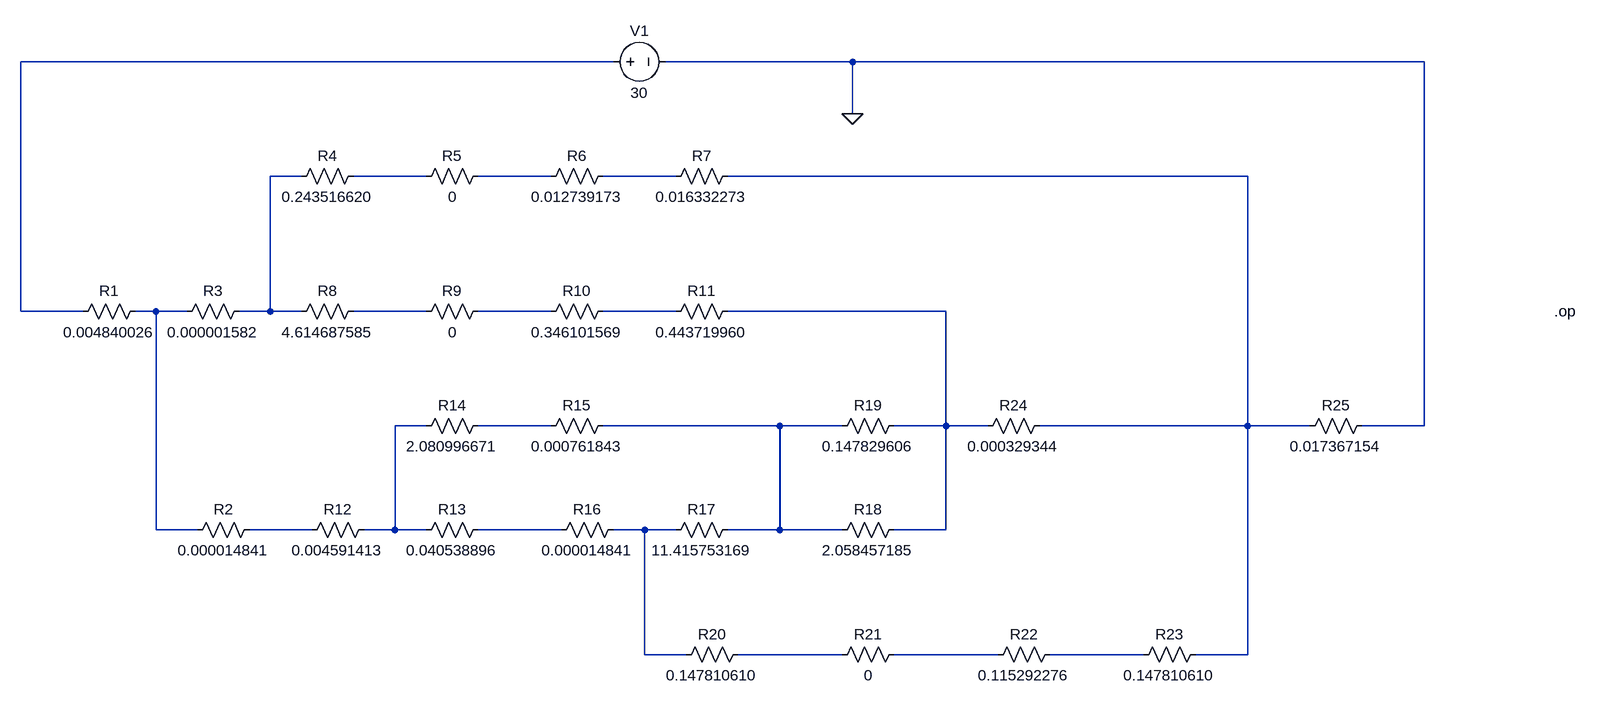
[diagram p0: schematic ceiling_thermal_model_xps.asc]
ceiling_thermal_model_xps.asc, the LTspice schematic file:
Version 4
SHEET 1 1964 856
WIRE 480 -96 -432 -96
WIRE 848 -96 560 -96
WIRE 1728 -96 848 -96
WIRE 848 -16 848 -96
WIRE 0 80 -48 80
WIRE 192 80 80 80
WIRE 384 80 272 80
WIRE 576 80 464 80
WIRE 1456 80 656 80
WIRE -432 288 -432 -96
WIRE -336 288 -432 288
WIRE -224 288 -256 288
WIRE -176 288 -224 288
WIRE -48 288 -48 80
WIRE -48 288 -96 288
WIRE 0 288 -48 288
WIRE 192 288 80 288
WIRE 384 288 272 288
WIRE 576 288 464 288
WIRE 992 288 656 288
WIRE 192 464 144 464
WIRE 384 464 272 464
WIRE 736 464 464 464
WIRE 832 464 736 464
WIRE 992 464 992 288
WIRE 992 464 912 464
WIRE 1056 464 992 464
WIRE 1456 464 1456 80
WIRE 1456 464 1136 464
WIRE 1552 464 1456 464
WIRE 1728 464 1728 -96
WIRE 1728 464 1632 464
WIRE -224 624 -224 288
WIRE -160 624 -224 624
WIRE 16 624 -80 624
WIRE 144 624 144 464
WIRE 144 624 96 624
WIRE 192 624 144 624
WIRE 400 624 272 624
WIRE 528 624 480 624
WIRE 576 624 528 624
WIRE 736 624 736 464
WIRE 736 624 656 624
WIRE 832 624 736 624
WIRE 992 624 992 464
WIRE 992 624 912 624
WIRE 528 816 528 624
WIRE 592 816 528 816
WIRE 832 816 672 816
WIRE 1072 816 912 816
WIRE 1296 816 1152 816
WIRE 1456 816 1456 464
WIRE 1456 816 1376 816
FLAG 848 -16 0
SYMBOL res -352 304 R270
WINDOW 0 32 56 VTop 2
WINDOW 3 0 56 VBottom 2
SYMATTR InstName R1
SYMATTR Value 0.004840026
SYMBOL res -176 640 R270
WINDOW 0 32 56 VTop 2
WINDOW 3 0 56 VBottom 2
SYMATTR InstName R2
SYMATTR Value 0.000014841
SYMBOL res -192 304 R270
WINDOW 0 32 56 VTop 2
WINDOW 3 0 56 VBottom 2
SYMATTR InstName R3
SYMATTR Value 0.000001582
SYMBOL res -16 96 R270
WINDOW 0 32 56 VTop 2
WINDOW 3 0 56 VBottom 2
SYMATTR InstName R4
SYMATTR Value 0.243516620
SYMBOL res 176 96 R270
WINDOW 0 32 56 VTop 2
WINDOW 3 0 56 VBottom 2
SYMATTR InstName R5
SYMATTR Value 0
SYMBOL res 368 96 R270
WINDOW 0 32 56 VTop 2
WINDOW 3 0 56 VBottom 2
SYMATTR InstName R6
SYMATTR Value 0.012739173
SYMBOL res 560 96 R270
WINDOW 0 32 56 VTop 2
WINDOW 3 0 56 VBottom 2
SYMATTR InstName R7
SYMATTR Value 0.016332273
SYMBOL res -16 304 R270
WINDOW 0 32 56 VTop 2
WINDOW 3 0 56 VBottom 2
SYMATTR InstName R8
SYMATTR Value 4.614687585
SYMBOL res 176 304 R270
WINDOW 0 32 56 VTop 2
WINDOW 3 0 56 VBottom 2
SYMATTR InstName R9
SYMATTR Value 0
SYMBOL res 368 304 R270
WINDOW 0 32 56 VTop 2
WINDOW 3 0 56 VBottom 2
SYMATTR InstName R10
SYMATTR Value 0.346101569
SYMBOL res 560 304 R270
WINDOW 0 32 56 VTop 2
WINDOW 3 0 56 VBottom 2
SYMATTR InstName R11
SYMATTR Value 0.443719960
SYMBOL res 0 640 R270
WINDOW 0 32 56 VTop 2
WINDOW 3 0 56 VBottom 2
SYMATTR InstName R12
SYMATTR Value 0.004591413
SYMBOL res 176 640 R270
WINDOW 0 32 56 VTop 2
WINDOW 3 0 56 VBottom 2
SYMATTR InstName R13
SYMATTR Value 0.040538896
SYMBOL res 176 480 R270
WINDOW 0 32 56 VTop 2
WINDOW 3 0 56 VBottom 2
SYMATTR InstName R14
SYMATTR Value 2.080996671
SYMBOL res 368 480 R270
WINDOW 0 32 56 VTop 2
WINDOW 3 0 56 VBottom 2
SYMATTR InstName R15
SYMATTR Value 0.000761843
SYMBOL res 384 640 R270
WINDOW 0 32 56 VTop 2
WINDOW 3 0 56 VBottom 2
SYMATTR InstName R16
SYMATTR Value 0.000014841
SYMBOL res 560 640 R270
WINDOW 0 32 56 VTop 2
WINDOW 3 0 56 VBottom 2
SYMATTR InstName R17
SYMATTR Value 11.415753169
SYMBOL res 816 640 R270
WINDOW 0 32 56 VTop 2
WINDOW 3 0 56 VBottom 2
SYMATTR InstName R18
SYMATTR Value 2.058457185
SYMBOL res 816 480 R270
WINDOW 0 32 56 VTop 2
WINDOW 3 0 56 VBottom 2
SYMATTR InstName R19
SYMATTR Value 0.147829606
SYMBOL res 576 832 R270
WINDOW 0 32 56 VTop 2
WINDOW 3 0 56 VBottom 2
SYMATTR InstName R20
SYMATTR Value 0.147810610
SYMBOL res 816 832 R270
WINDOW 0 32 56 VTop 2
WINDOW 3 0 56 VBottom 2
SYMATTR InstName R21
SYMATTR Value 0
SYMBOL res 1056 832 R270
WINDOW 0 32 56 VTop 2
WINDOW 3 0 56 VBottom 2
SYMATTR InstName R22
SYMATTR Value 0.115292276
SYMBOL res 1280 832 R270
WINDOW 0 32 56 VTop 2
WINDOW 3 0 56 VBottom 2
SYMATTR InstName R23
SYMATTR Value 0.147810610
SYMBOL res 1040 480 R270
WINDOW 0 32 56 VTop 2
WINDOW 3 0 56 VBottom 2
SYMATTR InstName R24
SYMATTR Value 0.000329344
SYMBOL res 1536 480 R270
WINDOW 0 32 56 VTop 2
WINDOW 3 0 56 VBottom 2
SYMATTR InstName R25
SYMATTR Value 0.017367154
SYMBOL voltage 464 -96 R270
WINDOW 0 32 56 VTop 2
WINDOW 3 -32 56 VBottom 2
SYMATTR InstName V1
SYMATTR Value 30
SYMATTR SpiceLine Rser=0
TEXT 1928 288 Left 2 !.op

The netlist it stands for:
* ceiling_thermal_model_xps.asc
R1 N001 N007 0.004840026
R2 N007 N015 0.000014841
R3 N007 N002 0.000001582
R4 N002 N003 0.243516620
R5 N003 N004 0
R6 N004 N005 0.012739173
R7 N005 N006 0.016332273
R8 N002 N008 4.614687585
R9 N008 N009 0
R10 N009 N010 0.346101569
R11 N010 N011 0.443719960
R12 N015 N012 0.004591413
R13 N012 N016 0.040538896
R14 N012 N013 2.080996671
R15 N013 N014 0.000761843
R16 N016 N017 0.000014841
R17 N017 N014 11.415753169
R18 N014 N011 2.058457185
R19 N014 N011 0.147829606
R20 N017 N018 0.147810610
R21 N018 N019 0
R22 N019 N020 0.115292276
R23 N020 N006 0.147810610
R24 N011 N006 0.000329344
R25 N006 0 0.017367154
V1 N001 0 30 Rser=0
.op
.backanno
.end